# EAGLE schematic Rocky Switch SSR (EAGLE 7.6.0)
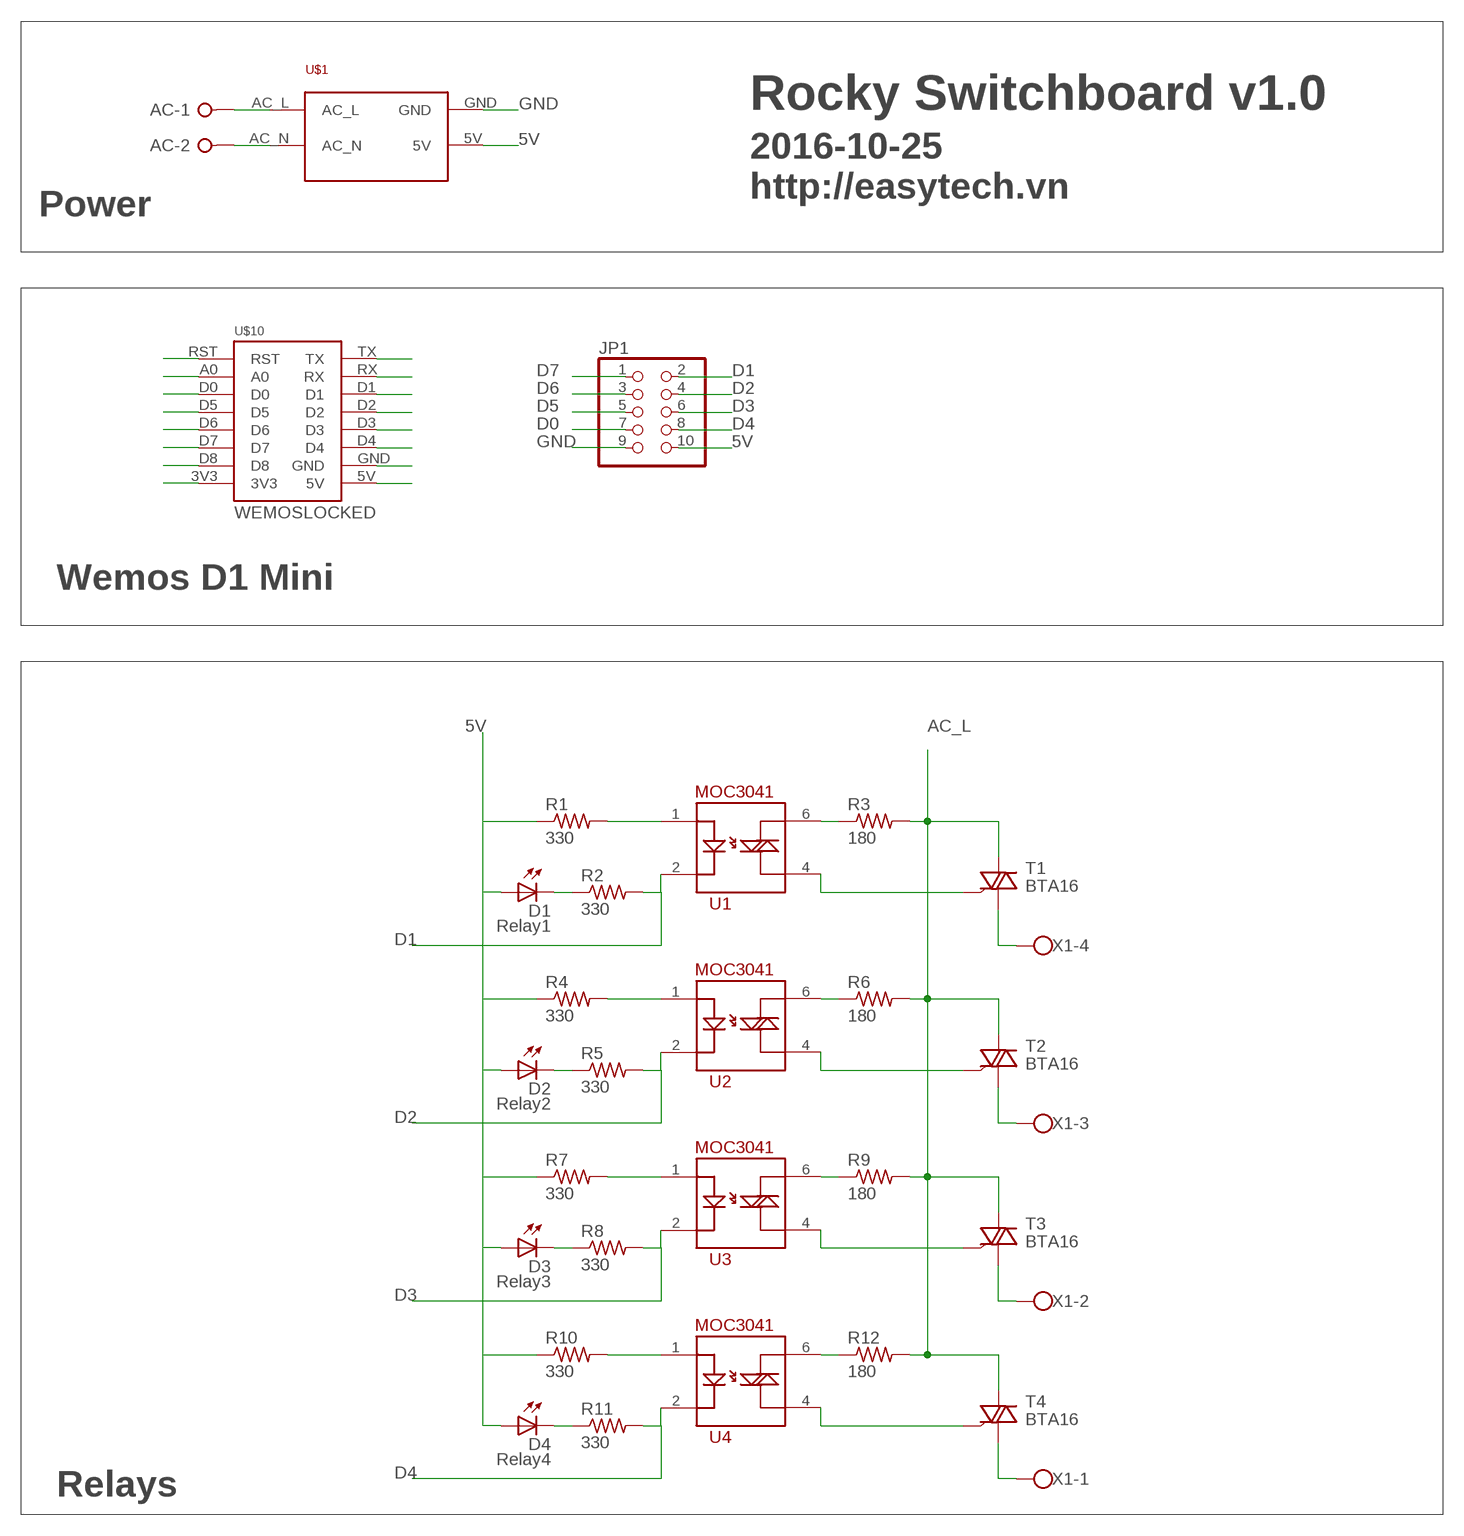
[diagram p0: schematic, sheet 1]

## Parts
AC  W237-02P  [W237-132]
D1  Relay1  LEDCHIP-LED0805  [CHIP-LED0805]
D2  Relay2  LEDCHIP-LED0805  [CHIP-LED0805]
D3  Relay3  LEDCHIP-LED0805  [CHIP-LED0805]
D4  Relay4  LEDCHIP-LED0805  [CHIP-LED0805]
JP1  PINHD-2X5  [2X05]
R1  330  R-US_R0805  [R0805]
R2  330  R-US_R0805  [R0805]
R3  180  R-US_0204/7  [0204/7]
R4  330  R-US_R0805  [R0805]
R5  330  R-US_R0805  [R0805]
R6  180  R-US_0204/7  [0204/7]
R7  330  R-US_R0805  [R0805]
R8  330  R-US_R0805  [R0805]
R9  180  R-US_0204/7  [0204/7]
R10  330  R-US_R0805  [R0805]
R11  330  R-US_R0805  [R0805]
R12  180  R-US_0204/7  [0204/7]
T1  BTA16  BT138-V  [TO220BV]
T2  BTA16  BT138-V  [TO220BV]
T3  BTA16  BT138-V  [TO220BV]
T4  BTA16  BT138-V  [TO220BV]
U1  MOC3041  MOC3031-M  [DIL06]
U2  MOC3041  MOC3031-M  [DIL06]
U3  MOC3041  MOC3031-M  [DIL06]
U4  MOC3041  MOC3031-M  [DIL06]
U$1  POWER_SUPPLY_220VAC_5V  [POWER_SUPPLY_220VAC_5V]
U$10  WEMOSLOCKED  [WEMOS_LOCKED]
X1  W237-4  [W237-4]

## Nets
3V3: U$10.3V3
5V: D1.A D2.A D3.A D4.A JP1.10 R1.1 R4.1 R7.1 R10.1 U$1.5V U$10.5V
A0: U$10.A0
AC_L: AC.1 R3.2 R6.2 R9.2 R12.2 T1.T2(A2) T2.T2(A2) T3.T2(A2) T4.T2(A2) U$1.AC_L
AC_N: AC.2 U$1.AC_N
D0: JP1.7 U$10.D0
D1: JP1.2 R2.2 U1.2 U$10.D1
D2: JP1.4 R5.2 U2.2 U$10.D2
D3: JP1.6 R8.2 U3.2 U$10.D3
D4: JP1.8 R11.2 U4.2 U$10.D4
D5: JP1.5 U$10.D5
D6: JP1.3 U$10.D6
D7: JP1.1 U$10.D7
D8: U$10.D8
GND: JP1.9 U$1.GND U$10.GND
N$9: T1.G U1.4
N$10: R1.2 U1.1
N$14: R3.1 U1.6
N$15: T2.G U2.4
N$16: R4.2 U2.1
N$17: R6.1 U2.6
N$18: T3.G U3.4
N$19: R7.2 U3.1
N$20: R9.1 U3.6
N$21: T3.T1(A1) X1.2
N$22: T2.T1(A1) X1.3
N$23: T1.T1(A1) X1.4
N$28: D1.C R2.1
N$29: D2.C R5.1
N$30: D3.C R8.1
N$32: T4.G U4.4
N$33: R10.2 U4.1
N$34: R12.1 U4.6
N$35: T4.T1(A1) X1.1
N$38: D4.C R11.1
RST1: U$10.RST
RX: U$10.RX
TX: U$10.TX

## Notes on the sheet
- Rocky Switchboard v1.0
- 2016-10-25
  http://easytech.vn
- Power
- Wemos D1 Mini
- Relays

## Library data of the parts
AC = con-wago-508:W237-02P: WAGO SREW CLAMP; OC_FARNELL: unknown; OC_NEWARK: unknown
D1-D4 = adafruit:LED: LED OSRAM: - CHIPLED LG R971, LG N971, LY N971, LG Q971, LY Q971, LO R971, LY R971 LH N974, LH R974 LS Q976, LO Q976, LY Q976 LO Q996 - Hyper CHIPLED LW Q18S LB Q993, LB Q99A, LB R99A - SideLED LS A670, LO A670, LY A670, LG A670, LP A670 LB A673, LV A673, LT A673, LW A673 LH A674 LY A675 LS A676, LA A676, LO A676, LY A676, LW A676 LS A679, LY A679, LG A679 - Hyper Micro SIDELED® LS Y876, LA Y876, LO Y876, LY Y876 LT Y87S - SmartLED LW L88C, LW L88S LB L89C, LB L89S, LG L890 LS L89K, LO L89K, LY L89K LS L896, LA L896, LO L896, LY L896 - TOPLED LS T670, LO T670, LY T670, LG T670, LP T670 LSG T670, LSP T670, LSY T670, LOP T670, LYG T670 LG T671, LOG T671, LSG T671 LB T673, LV T673, LT T673, LW T673 LH T674 LS T676, LA T676, LO T676, LY T676, LB T676, LH T676, LSB T676, LW T676 LB T67C, LV T67C, LT T67C, LS T67K, LO T67K, LY T67K, LW E67C LS E67B, LA E67B, LO E67B, LY E67B, LB E67C, LV E67C, LT E67C LW T67C LS T679, LY T679, LG T679 LS T770, LO T770, LY T770, LG T770, LP T770 LB T773, LV T773, LT T773, LW T773 LH T774 LS E675, LA E675, LY E675, LS T675 LS T776, LA T776, LO T776, LY T776, LB T776 LHGB T686 LT T68C, LB T68C - Hyper Mini TOPLED® LB M676 - Mini TOPLED Santana® LG M470 LS M47K, LO M47K, LY M47K Source: http://www.osram.convergy.de/
JP1 = pinhead:PINHD-2X5: PIN HEADER
R1-R12 = rcl:R-US_: RESISTOR, American symbol
T1-T4 = triac:BT138: TRIAC Source: http://www.semiconductors.philips.com BT138_SERIES_2.pdf
U1-U4 = SparkFun-DiscreteSemi:MOC3031-M: Opto-isolated TRIAC
U$1 = My Eagle Lib:POWER_SUPPLY_220VAC_5V
U$10 = My Eagle Lib:WEMOS
X1 = con-wago-500:W237-4: WAGO SCREW CLAMP; OC_FARNELL: unknown; OC_NEWARK: unknown